# EAGLE design hsi_atmega (EAGLE 5.09)
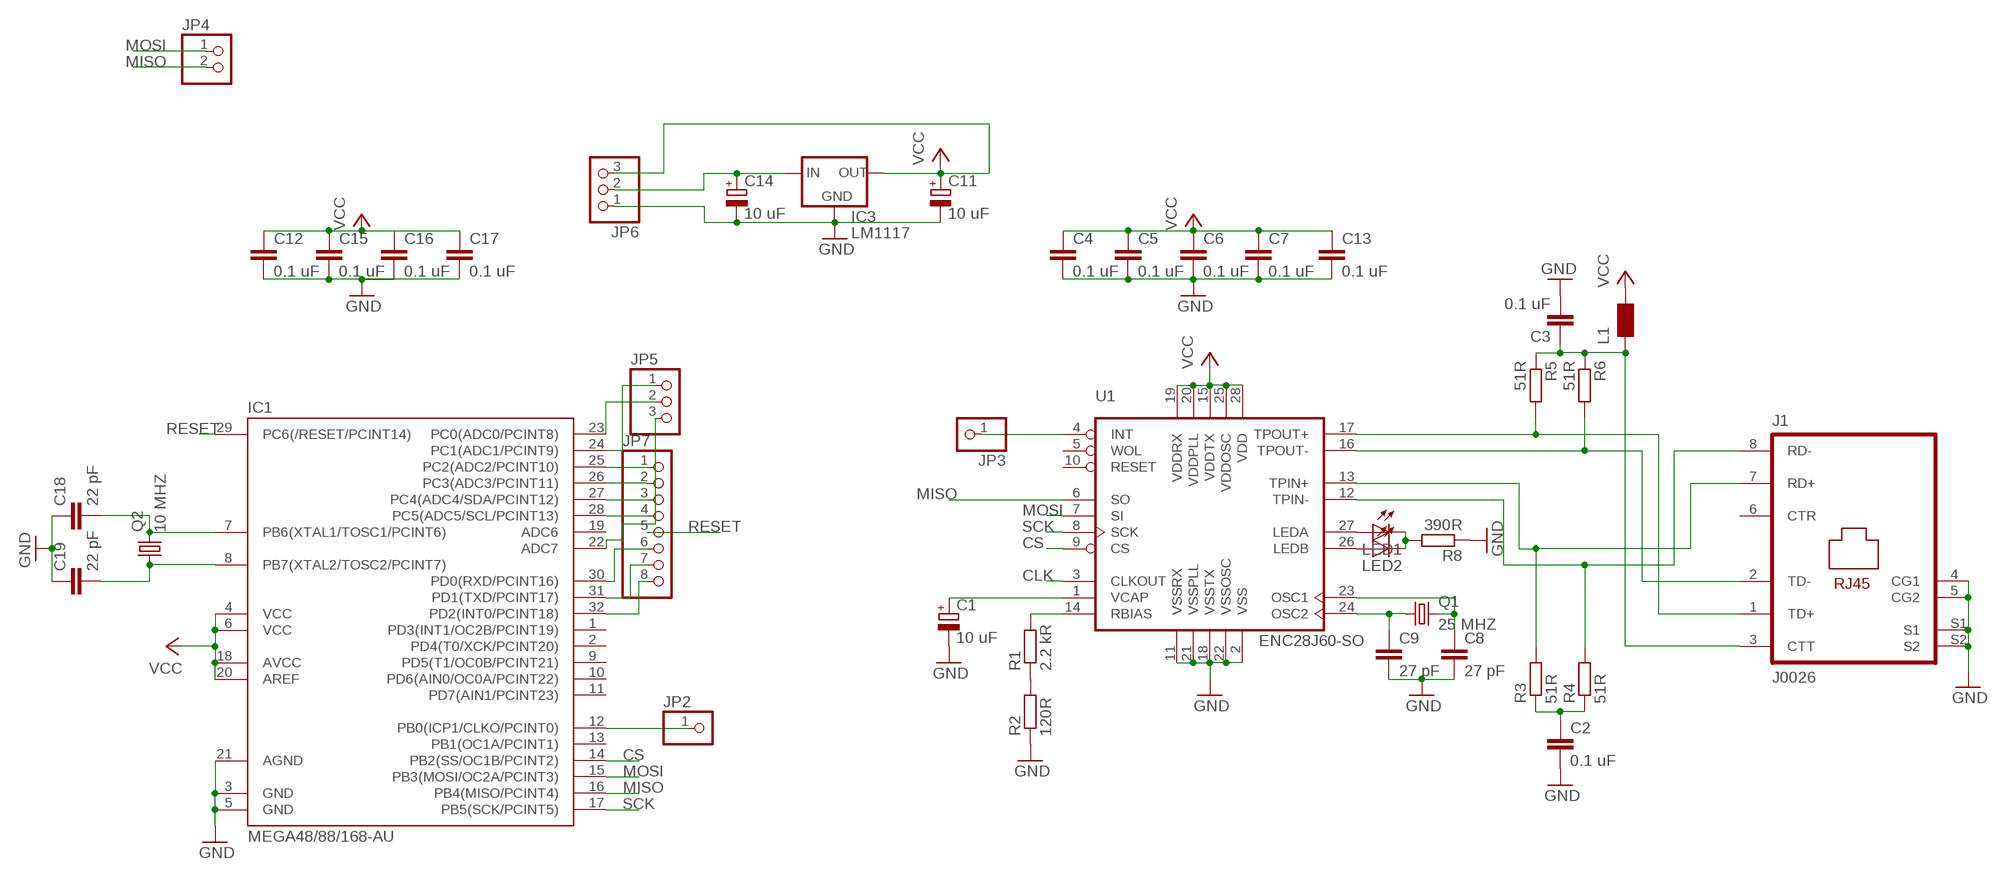
[diagram p0: schematic, sheet 1]

## Parts
C1  10 uF  CPOL-EUCT3216  [CT3216]
C2  0.1 uF  C-EUC0805  [C0805]
C3  0.1 uF  C-EUC0805  [C0805]
C4  0.1 uF  C-EUC0805  [C0805]
C5  0.1 uF  C-EUC0805  [C0805]
C6  0.1 uF  C-EUC0805  [C0805]
C7  0.1 uF  C-EUC0805  [C0805]
C8  27 pF  C-EUC0805  [C0805]
C9  27 pF  C-EUC0805  [C0805]
C11  10 uF  CPOL-EUCT3216  [CT3216]
C12  0.1 uF  C-EUC0805  [C0805]
C13  0.1 uF  C-EUC0805  [C0805]
C14  10 uF  CPOL-EUCT3216  [CT3216]
C15  0.1 uF  C-EUC0805  [C0805]
C16  0.1 uF  C-EUC0805  [C0805]
C17  0.1 uF  C-EUC0805  [C0805]
C18  22 pF  C-EUC0805  [C0805]
C19  22 pF  C-EUC0805  [C0805]
IC1  MEGA48/88/168-AU  [TQFP32-08]
IC3  LM1117  [SOT223]
J1  J0026  [PJ-J0]
JP2  PINHD-1X1  [1X01]
JP3  PINHD-1X1  [1X01]
JP4  PINHD-1X2  [1X02]
JP5  PINHD-1X3  [1X03]
JP6  PINHD-1X3  [1X03]
JP7  PINHD-1X8  [1X08]
L1  WE-KI_0805_B  [WE-KI_0805_B]
LED1  LEDCHIPLED_0805  [CHIPLED_0805]
LED2  LEDCHIPLED_0805  [CHIPLED_0805]
Q1  25 MHZ  CRYSTALHC49UP  [HC49UP]
Q2  10 MHZ  CRYSTALHC49UP  [HC49UP]
R1  2.2 kR  R-EU_M0805  [M0805]
R2  120R  R-EU_M0805  [M0805]
R3  51R  R-EU_M0805  [M0805]
R4  51R  R-EU_M0805  [M0805]
R5  51R  R-EU_M0805  [M0805]
R6  51R  R-EU_M0805  [M0805]
R8  390R  R-EU_M0805  [M0805]
U1  ENC28J60-SO  [SO28W]

## Nets
CLK: U1.3(CLKOUT)
CS: IC1.14(PB2(SS/OC1B/PCINT2)) U1.9(CS)
GND: C1.- C2.2 C3.2 C4.2 C5.2 C6.2 C7.2 C8.2 C9.2 C11.- C12.2 C13.2 C14.- C15.2 C16.2 C17.2 C18.1 C19.1 IC1.3(GND) IC1.5(GND) IC1.21(AGND) IC3.1(GND) J1.4(CG1) J1.5(CG2) J1.S1 J1.S2 JP6.1 R2.1 R8.1 U1.2(VSS) U1.11(VSSRX) U1.18(VSSTX) U1.21(VSSPLL) U1.22(VSSOSC)
MISO: IC1.16(PB4(MISO/PCINT4)) JP4.2 U1.6(SO)
MOSI: IC1.15(PB3(MOSI/OC2A/PCINT3)) JP4.1 U1.7(SI)
N$1: R1.1 R2.2
N$2: R1.2 U1.14(RBIAS)
N$3: C1.+ U1.1(VCAP)
N$4: IC1.12(PB0(ICP1/CLKO/PCINT0)) JP2.1
N$5: C2.1 R3.1 R4.1
N$6: C8.1 Q1.2 U1.23(OSC1)
N$7: C3.1 J1.3(CTT) L1.2 R5.1 R6.1
N$8: J1.1(TD+) R5.2 U1.17(TPOUT+)
N$9: J1.2(TD-) R6.2 U1.16(TPOUT-)
N$11: J1.7(RD+) R3.2 U1.13(TPIN+)
N$13: C19.2 IC1.8(PB7(XTAL2/TOSC2/PCINT7)) Q2.1
N$14: J1.8(RD-) R4.2 U1.12(TPIN-)
N$15: C9.1 Q1.1 U1.24(OSC2)
N$16: LED2.A U1.26(LEDB)
N$17: C14.+ IC3.3(IN) JP6.2
N$18: JP3.1 U1.4(INT)
N$19: C18.2 IC1.7(PB6(XTAL1/TOSC1/PCINT6)) Q2.2
N$20: LED1.A U1.27(LEDA)
N$21: LED1.C LED2.C R8.2
N$22: IC1.25(PC2(ADC2/PCINT10)) JP7.1
N$23: IC1.26(PC3(ADC3/PCINT11)) JP7.2
N$24: IC1.27(PC4(ADC4/SDA/PCINT12)) JP7.3
N$25: IC1.28(PC5(ADC5/SCL/PCINT13)) JP7.4
N$26: IC1.23(PC0(ADC0/PCINT8)) JP5.2
N$27: IC1.30(PD0(RXD/PCINT16)) JP7.6
N$28: IC1.31(PD1(TXD/PCINT17)) JP7.7
N$29: IC1.32(PD2(INT0/PCINT18)) JP7.8
N$31: IC1.22(ADC7) JP5.3
N$32: IC1.24(PC1(ADC1/PCINT9)) JP5.1
RESET: IC1.29(PC6(/RESET/PCINT14)) JP7.5
SCK: IC1.17(PB5(SCK/PCINT5)) U1.8(SCK)
VCC: C4.1 C5.1 C6.1 C7.1 C11.+ C12.1 C13.1 C15.1 C16.1 C17.1 IC1.4(VCC) IC1.6(VCC) IC1.18(AVCC) IC1.20(AREF) IC3.2(OUT) JP6.3 L1.1 U1.15(VDDTX) U1.19(VDDRX) U1.20(VDDPLL) U1.25(VDDOSC) U1.28(VDD)
Unconnected: IC1.1(PD3(INT1/OC2B/PCINT19)) IC1.2(PD4(T0/XCK/PCINT20)) IC1.9(PD5(T1/OC0B/PCINT21)) IC1.10(PD6(AIN0/OC0A/PCINT22)) IC1.11(PD7(AIN1/PCINT23)) IC1.13(PB1(OC1A/PCINT1)) IC1.19(ADC6) J1.6(CTR) U1.5(WOL) U1.10(RESET)

## Library data of the parts
C1 C11 C14 = rcl:CPOL-EU: POLARIZED CAPACITOR, European symbol
C2-C9 C12 C13 C15-C19 = rcl:C-EU: CAPACITOR, European symbol
IC1 = avr-6:MEGA48/88/168
IC3 = v-reg-2:LM1117
J1 = con-pulse:J0026: RJ45 PulseJack w/LEDs
JP2 JP3 = pinhead:PINHD-1X1: PIN HEADER
JP4 = pinhead:PINHD-1X2: PIN HEADER
JP5 JP6 = pinhead:PINHD-1X3: PIN HEADER
JP7 = pinhead:PINHD-1X8: PIN HEADER
L1 = wuerth-elektronik:WE-KI: SMD Wire Wound Ceramic Inductor WE-KI - Wire wound - High thermal stability - Rated current up to 1 A - High Q-factor - High SRF -- Especially developed for high frequency applications -- Perfect for applications in telecommunications -- Bluetooth -- Wireless LAN
LED1 LED2 = led:LED: LED OSRAM: - CHIPLED LG R971, LG N971, LY N971, LG Q971, LY Q971, LO R971, LY R971 LH N974, LH R974 LS Q976, LO Q976, LY Q976 LO Q996 - Hyper CHIPLED LW Q18S LB Q993, LB Q99A, LB R99A - SideLED LS A670, LO A670, LY A670, LG A670, LP A670 LB A673, LV A673, LT A673, LW A673 LH A674 LY A675 LS A676, LA A676, LO A676, LY A676, LW A676 LS A679, LY A679, LG A679 - Hyper Micro SIDELED® LS Y876, LA Y876, LO Y876, LY Y876 LT Y87S - SmartLED LW L88C, LW L88S LB L89C, LB L89S, LG L890 LS L89K, LO L89K, LY L89K LS L896, LA L896, LO L896, LY L896 - TOPLED LS T670, LO T670, LY T670, LG T670, LP T670 LSG T670, LSP T670, LSY T670, LOP T670, LYG T670 LG T671, LOG T671, LSG T671 LB T673, LV T673, LT T673, LW T673 LH T674 LS T676, LA T676, LO T676, LY T676, LB T676, LH T676, LSB T676, LW T676 LB T67C, LV T67C, LT T67C, LS T67K, LO T67K, LY T67K, LW E67C LS E67B, LA E67B, LO E67B, LY E67B, LB E67C, LV E67C, LT E67C LW T67C LS T679, LY T679, LG T679 LS T770, LO T770, LY T770, LG T770, LP T770 LB T773, LV T773, LT T773, LW T773 LH T774 LS E675, LA E675, LY E675, LS T675 LS T776, LA T776, LO T776, LY T776, LB T776 LHGB T686 LT T68C, LB T68C - Hyper Mini TOPLED® LB M676 - Mini TOPLED Santana® LG M470 LS M47K, LO M47K, LY M47K Source: http://www.osram.convergy.de LUXEON: - LUMILED® LXK2-PW12-R00, LXK2-PW12-S00, LXK2-PW14-U00, LXK2-PW14-V00 LXK2-PM12-R00, LXK2-PM12-S00, LXK2-PM14-U00 LXK2-PE12-Q00, LXK2-PE12-R00, LXK2-PE12-S00, LXK2-PE14-T00, LXK2-PE14-U00 LXK2-PB12-K00, LXK2-PB12-L00, LXK2-PB12-M00, LXK2-PB14-N00, LXK2-PB14-P00, LXK2-PB14-Q00 LXK2-PR12-L00, LXK2-PR12-M00, LXK2-PR14-Q00, LXK2-PR14-R00 LXK2-PD12-Q00, LXK2-PD12-R00, LXK2-PD12-S00 LXK2-PH12-R00, LXK2-PH12-S00 LXK2-PL12-P00, LXK2-PL12-Q00, LXK2-PL12-R00 Source: www.luxeon.com KINGBRIGHT: KA-3528ASYC Source: www.kingbright.com
Q1 Q2 = crystal:CRYSTAL: CRYSTAL
R1-R6 R8 = rcl:R-EU_: RESISTOR, European symbol
U1 = microchip-enc28j60:ENC28J60-*: Microchip 10Mbit Eth. contoller with SPI interface

## Board
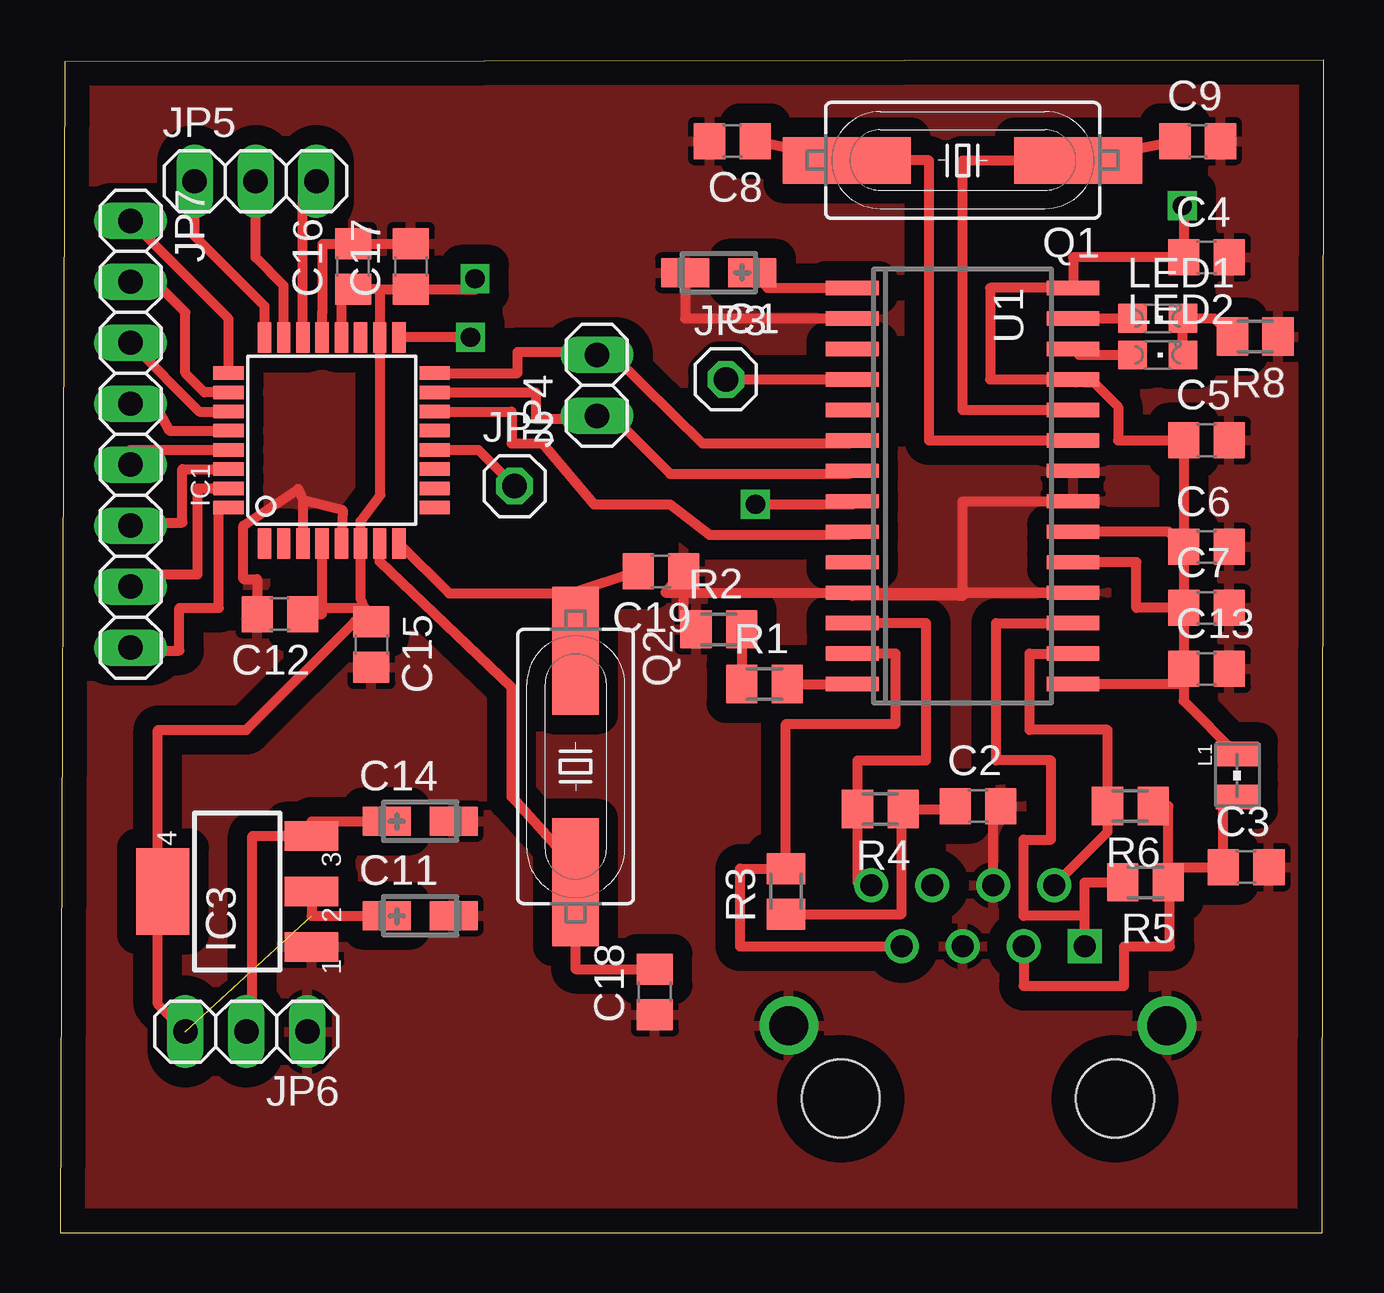
[diagram p1: board, top side]
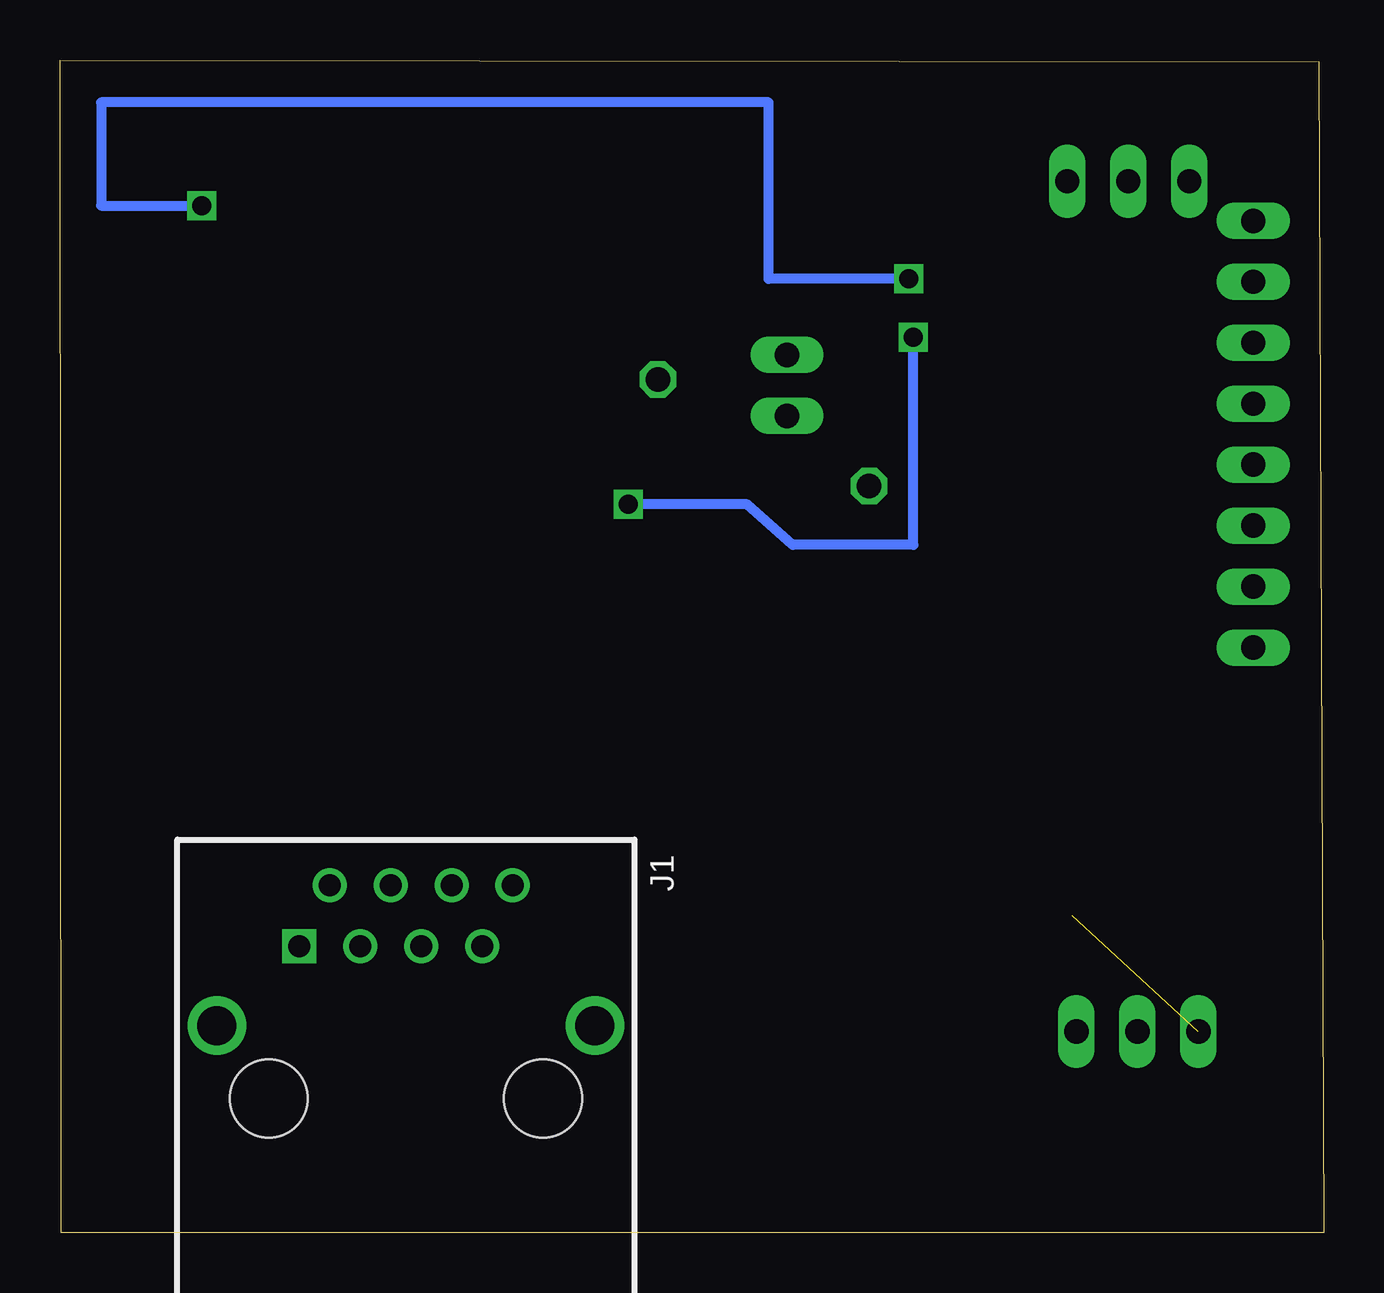
[diagram p2: board, bottom side, seen from below]

Size 52.66 x 48.87 mm. Coordinates in mm from the lower left corner, seen from the top.
Outline: 0,0 52.6,0 52.66,48.87 0.2,48.8 0,0
Copper layers (1*16): Top 0.035mm / dielectric 1.5mm / Bottom 0.035mm
Design rules "default": minimum track width 10mil, minimum drill 24mil, track to track 8mil, track to pad 8mil, pad to pad 8mil, via to via 8mil, smd to smd 8mil, copper to edge 40mil, drill to drill 8mil, minimum pad ring 10mil, minimum via ring 8mil, stop-mask expansion 4mil, vias tented up to drill 0mil, thermal gap 10mil

### Footprints (pad centres in the part's own frame; a part is rotated, then mirrored left to right if it is on the bottom)
CT3216 = smd 2 x 1.2: + -1.4,0; - 1.4,0
C0805 = smd 1.3 x 1.5: 1 -0.95,0; 2 0.95,0
TQFP32-08 = smd 1.27 x 0.559: 1 -4.293,2.8; 2 -4.293,2; 3 -4.293,1.2; 4 -4.293,0.4; 5 -4.293,-0.4; 6 -4.293,-1.2; 7 -4.293,-2; 8 -4.293,-2.8; 17 4.293,-2.8; 18 4.293,-2; 19 4.293,-1.2; 20 4.293,-0.4; 21 4.293,0.4; 22 4.293,1.2; 23 4.293,2; 24 4.293,2.8 | smd 0.559 x 1.27: 9 -2.8,-4.293; 10 -2,-4.293; 11 -1.2,-4.293; 12 -0.4,-4.293; 13 0.4,-4.293; 14 1.2,-4.293; 15 2,-4.293; 16 2.8,-4.293; 25 2.8,4.293; 26 2,4.293; 27 1.2,4.293; 28 0.4,4.293; 29 -0.4,4.293; 30 -1.2,4.293; 31 -2,4.293; 32 -2.8,4.293
SOT223 = smd 1.219 x 2.235: 1 -2.311,-3.099; 2 0,-3.099; 3 2.311,-3.099 | smd 3.6 x 2.2: 4 0,3.099
PJ-J0 = drill 0.914 square: 1 4.445,-6.35 | drill 0.914 round: 2 3.175,-8.89; 3 1.905,-6.35; 4 0.635,-8.89; 5 -0.635,-6.35; 6 -1.905,-8.89; 7 -3.175,-6.35; 8 -4.445,-8.89 | drill 1.626 round: S1 -7.874,-3.048; S2 7.874,-3.048 | hole 3.251: -5.715,0; 5.715,0
1X01 = drill 1.016 octagon: 1 0,0
1X02 = drill 1.016 long: 1 -1.27,0; 2 1.27,0
1X03 = drill 1.016 long: 1 -2.54,0; 2 0,0; 3 2.54,0
1X08 = drill 1.016 long: 1 -8.89,0; 2 -6.35,0; 3 -3.81,0; 4 -1.27,0; 5 1.27,0; 6 3.81,0; 7 6.35,0; 8 8.89,0
WE-KI_0805_B = smd 1.02 x 1.78: 1 -0.89,0; 2 0.89,0
CHIPLED_0805 = smd 1.2 x 1.2: A 0,-1.05; C 0,1.05
HC49UP = smd 5.334 x 1.93: 1 -4.826,0; 2 4.826,0
M0805 = smd 1.3 x 1.6: 1 -0.95,0; 2 0.95,0
SO28W = smd 0.6 x 2.2: 1 -8.255,-4.6; 2 -6.985,-4.6; 3 -5.715,-4.6; 4 -4.445,-4.6; 5 -3.175,-4.6; 6 -1.905,-4.6; 7 -0.635,-4.6; 8 0.635,-4.6; 9 1.905,-4.6; 10 3.175,-4.6; 11 4.445,-4.6; 12 5.715,-4.6; 13 6.985,-4.6; 14 8.255,-4.6; 15 8.255,4.6; 16 6.985,4.6; 17 5.715,4.6; 18 4.445,4.6; 19 3.175,4.6; 20 1.905,4.6; 21 0.635,4.6; 22 -0.635,4.6; 23 -1.905,4.6; 24 -3.175,4.6; 25 -4.445,4.6; 26 -5.715,4.6; 27 -6.985,4.6; 28 -8.255,4.6

### Placement (x,y rotation side)
C1  27.45,40.01 180 top
C2  38.25,17.78 0 top
C3  49.42,15.24 0 top
C4  47.77,40.64 0 top
C5  47.77,33.02 0 top
C6  47.77,28.57 0 top
C7  47.77,26.04 0 top
C8  28.02,45.48 180 top
C9  47.41,45.48 0 top
C11  15.01,13.21 0 top
C12  9.16,25.78 180 top
C13  47.77,23.5 0 top
C14  15.01,17.14 0 top
C15  12.97,24.51 270 top
C16  12.21,40.26 90 top
C17  14.62,40.26 90 top
C18  24.78,10.03 90 top
C19  25.04,27.56 180 top
IC1  11.32,33.02 90 top
IC3  7.39,14.22 90 top
J1  38.25,5.59 180 bottom
JP2  18.94,31.11 0 top
JP3  27.75,35.56 0 top
JP4  22.37,35.31 90 top
JP5  8.15,43.81 0 top
JP6  7.77,8.38 180 top
JP7  2.94,33.27 270 top
L1  49.04,19.05 270 top
LED1  45.74,38.1 270 top
LED2  45.74,36.58 270 top
Q1  37.61,44.69 180 top
Q2  21.48,19.43 270 top
R1  29.36,22.86 0 top
R2  27.45,25.15 0 top
R3  30.24,14.22 90 top
R4  34.18,17.65 180 top
R5  45.23,14.61 180 top
R6  44.6,17.78 180 top
R8  49.8,37.34 180 top
U1  37.61,31.11 270 top

### Tracks (layer width: path | path; a pad name or v marks a point on that pad's centre or on a via)
CS
  Top 0.406: IC1.14 18.81,34.22 18.81,32.89 20.08,32.89 22.24,30.35 25.42,30.35 27.07,29.08 32.88,29.08 U1.9
GND
  Top 0.406: C12.2 8.21,27.24 7.64,27.24 7.64,29.46 9.93,30.99 10.12,30.54 | 10.12,30.54 IC1.3 | IC1.5 11.77,30.12 10.12,30.54 | C17.2 C16.2 10.94,41.21 10.94,38.35 10.92,38.35 IC1.21 | U1.2 26.05,38.1 C1.- | C2.2 38.88,17.78 J1.4 | U1.21 37.61,30.48 37.61,26.54 37.48,26.54 | 37.48,26.54 33.01,26.54 U1.11 | 37.48,26.54 37.48,26.67 U1.18 25.23,26.67 C19.1 25.99,25.66 R2.1
  pour Top (isolate 0.813): 1,48.6 52.6,48.4 52.49,0.25 0.78,0.38
MISO
  Top 0.406: IC1.16 19.07,35.82 19.07,36.7 22.37,36.7 JP4.2 23.01,36.58 26.76,32.89 32.88,32.89 U1.6
MOSI
  Top 0.406: IC1.15 19.83,35.02 19.83,33.91 22.37,33.91 | 22.37,33.91 JP4.1 | 22.37,33.91 23.13,33.91 25.42,31.62 32.88,31.62 U1.7
N$1
  Top 0.406: R2.2 R1.1
N$2
  Top 0.406: R1.2 U1.14
N$3
  Top 0.406: U1.1 29.49,39.37 C1.+
N$4
  Top 0.406: IC1.12 17.44,32.62 JP2.1
N$5
  Top 0.406: C2.1 37.3,17.65 R4.1 35.07,17.65 35.07,13.27 R3.1
N$6
  Top 0.406: U1.23 36.21,33.02 36.21,44.69 Q1.2 C8.1
N$7
  Top 0.406: R5.1 46.25,14.61 46.25,11.94 44.34,11.94 44.34,10.29 40.15,10.29 J1.3 | R5.1 46.18,15.24 C3.1 48.47,18.16 L1.2 | R5.1 46.18,17.78 R6.1
N$8
  Top 0.406: U1.17 39.01,25.4 39.01,19.68 41.29,19.68 41.29,16.38 40.15,16.38 40.15,13.21 42.69,13.21 J1.1 42.69,14.61 R5.2
N$9
  Top 0.406: U1.16 40.41,24.13 40.41,20.95 43.65,20.95 R6.2 43.65,16.7 J1.2
N$11
  Top 0.406: U1.13 34.82,24.13 34.82,21.21 30.24,21.21 R3.2 28.34,15.17 28.34,11.94 J1.7
N$13
  Top 0.406: 21.3,26.64 Q2.1 | 21.3,26.64 24.2,27.6 C19.2 | IC1.8 16.21,26.64 21.3,26.64
N$14
  Top 0.406: U1.12 36.09,25.4 36.09,19.68 33.23,19.68 R4.2 33.23,14.61 33.8,14.61 J1.8
N$15
  Top 0.406: C9.1 Q1.1 37.61,44.69 37.61,34.29 U1.24
N$16
  Top 0.406: LED2.A 42.46,36.58 U1.26
N$17
  Top 0.406: C14.+ 10.48,17.14 IC3.3 8.02,16.54 8.02,8.64 JP6.2
N$18
  Top 0.406: JP3.1 U1.4
N$19
  Top 0.406: C18.2 21.48,10.98 Q2.2 21.23,15.49 18.81,18.16 18.81,22.73 13.32,27.97 IC1.7
N$20
  Top 0.406: U1.27 LED1.A
N$21
  Top 0.406: LED2.C LED1.C 48.09,38.1 R8.2
N$22
  Top 0.406: IC1.25 7.03,38.08 JP7.1
N$23
  Top 0.406: IC1.26 6.02,35.02 5.23,35.81 5.23,38.35 3.96,39.62 JP7.2
N$24
  Top 0.406: IC1.27 5.8,34.22 JP7.3
N$25
  Top 0.406: IC1.28 4.56,33.42 3.96,34.54 JP7.4
N$26
  Top 0.406: IC1.23 9.32,39.47 8.15,40.64 JP5.2
N$27
  Top 0.406: IC1.30 5.1,31.82 5.1,29.59 2.94,29.59 JP7.6
N$28
  Top 0.406: IC1.31 5.73,31.02 5.73,27.43 2.94,27.43 JP7.7
N$29
  Top 0.406: IC1.32 6.62,30.22 6.62,26.04 4.97,26.04 4.97,24.26 2.94,24.26 JP7.8
N$31
  Top 0.406: IC1.22 10.12,43.25 JP5.3
N$32
  Top 0.406: IC1.24 8.52,38.61 5.61,41.53 JP5.1
RESET
  Top 0.406: IC1.29 2.94,32.62 JP7.5
SCK  (via drill 0.8)
  Top 0.406: v28.97,30.35 33.01,30.35 U1.8 | IC1.17 16.5,37.31 16.53,37.34 16.55,37.31 v17.1,37.31
  Bottom 0.406: v17.1,37.31 17.1,28.67 22.12,28.67 24.02,30.35 v28.97,30.35
VCC  (via drill 0.8)  (1 unrouted)
  Top 0.406: 42.69,35.43 43.07,35.43 44.09,34.42 44.09,33.02 C5.1 C6.1 | 42.69,35.43 42.34,35.43 U1.25 | C6.1 46.19,29.21 U1.20 | C6.1 C7.1 | U1.19 44.85,27.94 44.85,26.04 C7.1 | C7.1 C13.1 46.82,22.86 | 46.82,22.86 U1.15 | 46.82,22.86 46.82,22.16 L1.1 | 10.94,28.73 IC1.4 10.92,25.78 C12.1 10.11,26.03 12.71,26.03 | 12.71,26.03 C15.1 12.27,25.46 7.77,20.95 4.08,20.95 4.08,9.53 JP6.3 | 12.71,26.03 12.52,26.42 IC1.6 12.52,29.65 13.35,30.73 13.35,37.28 IC1.18 13.35,37.31 13.35,39.31 | IC3.2 10.48,13.21 C11.+ | 13.35,39.31 C17.1 17.29,39.31 v17.29,39.75 | IC1.20 11.72,39.31 C16.1 13.35,39.31 | v46.75,42.8 46.82,42.8 C4.1 42.21,40.64 U1.28 38.75,39.37 38.75,35.56 42.69,35.56 42.69,35.43
  Bottom 0.406: v17.29,39.75 23.13,39.75 23.13,47.1 50.95,47.1 50.95,42.8 v46.75,42.8